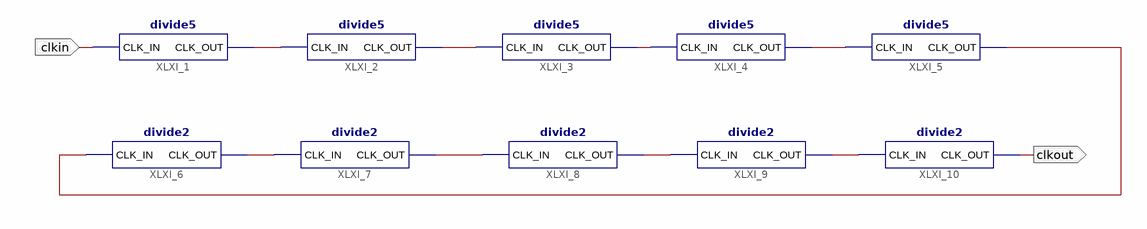
[diagram p0: schematic sheet 1]
// Xilinx ISE schematic divideTo200Hz.sch (spartan6) as structural Verilog: 10 symbols, 2 ports
module divideTo200Hz (
  input  clkin,
  output clkout
);

  wire XLXN_3, XLXN_4, XLXN_5, XLXN_6, XLXN_7, XLXN_9, XLXN_10, XLXN_11, XLXN_12;

  divide5 XLXI_1 (.CLK_IN(clkin), .CLK_OUT(XLXN_3));
  divide5 XLXI_2 (.CLK_IN(XLXN_3), .CLK_OUT(XLXN_4));
  divide5 XLXI_3 (.CLK_IN(XLXN_4), .CLK_OUT(XLXN_5));
  divide5 XLXI_4 (.CLK_IN(XLXN_5), .CLK_OUT(XLXN_6));
  divide5 XLXI_5 (.CLK_IN(XLXN_6), .CLK_OUT(XLXN_7));
  divide2 XLXI_6 (.CLK_IN(XLXN_7), .CLK_OUT(XLXN_9));
  divide2 XLXI_7 (.CLK_IN(XLXN_9), .CLK_OUT(XLXN_10));
  divide2 XLXI_8 (.CLK_IN(XLXN_10), .CLK_OUT(XLXN_11));
  divide2 XLXI_9 (.CLK_IN(XLXN_11), .CLK_OUT(XLXN_12));
  divide2 XLXI_10 (.CLK_IN(XLXN_12), .CLK_OUT(clkout));
endmodule
